# EAGLE schematic Embedded (EAGLE 9.2.1)
Assembly variants: 2

## Sheet 1 of 2
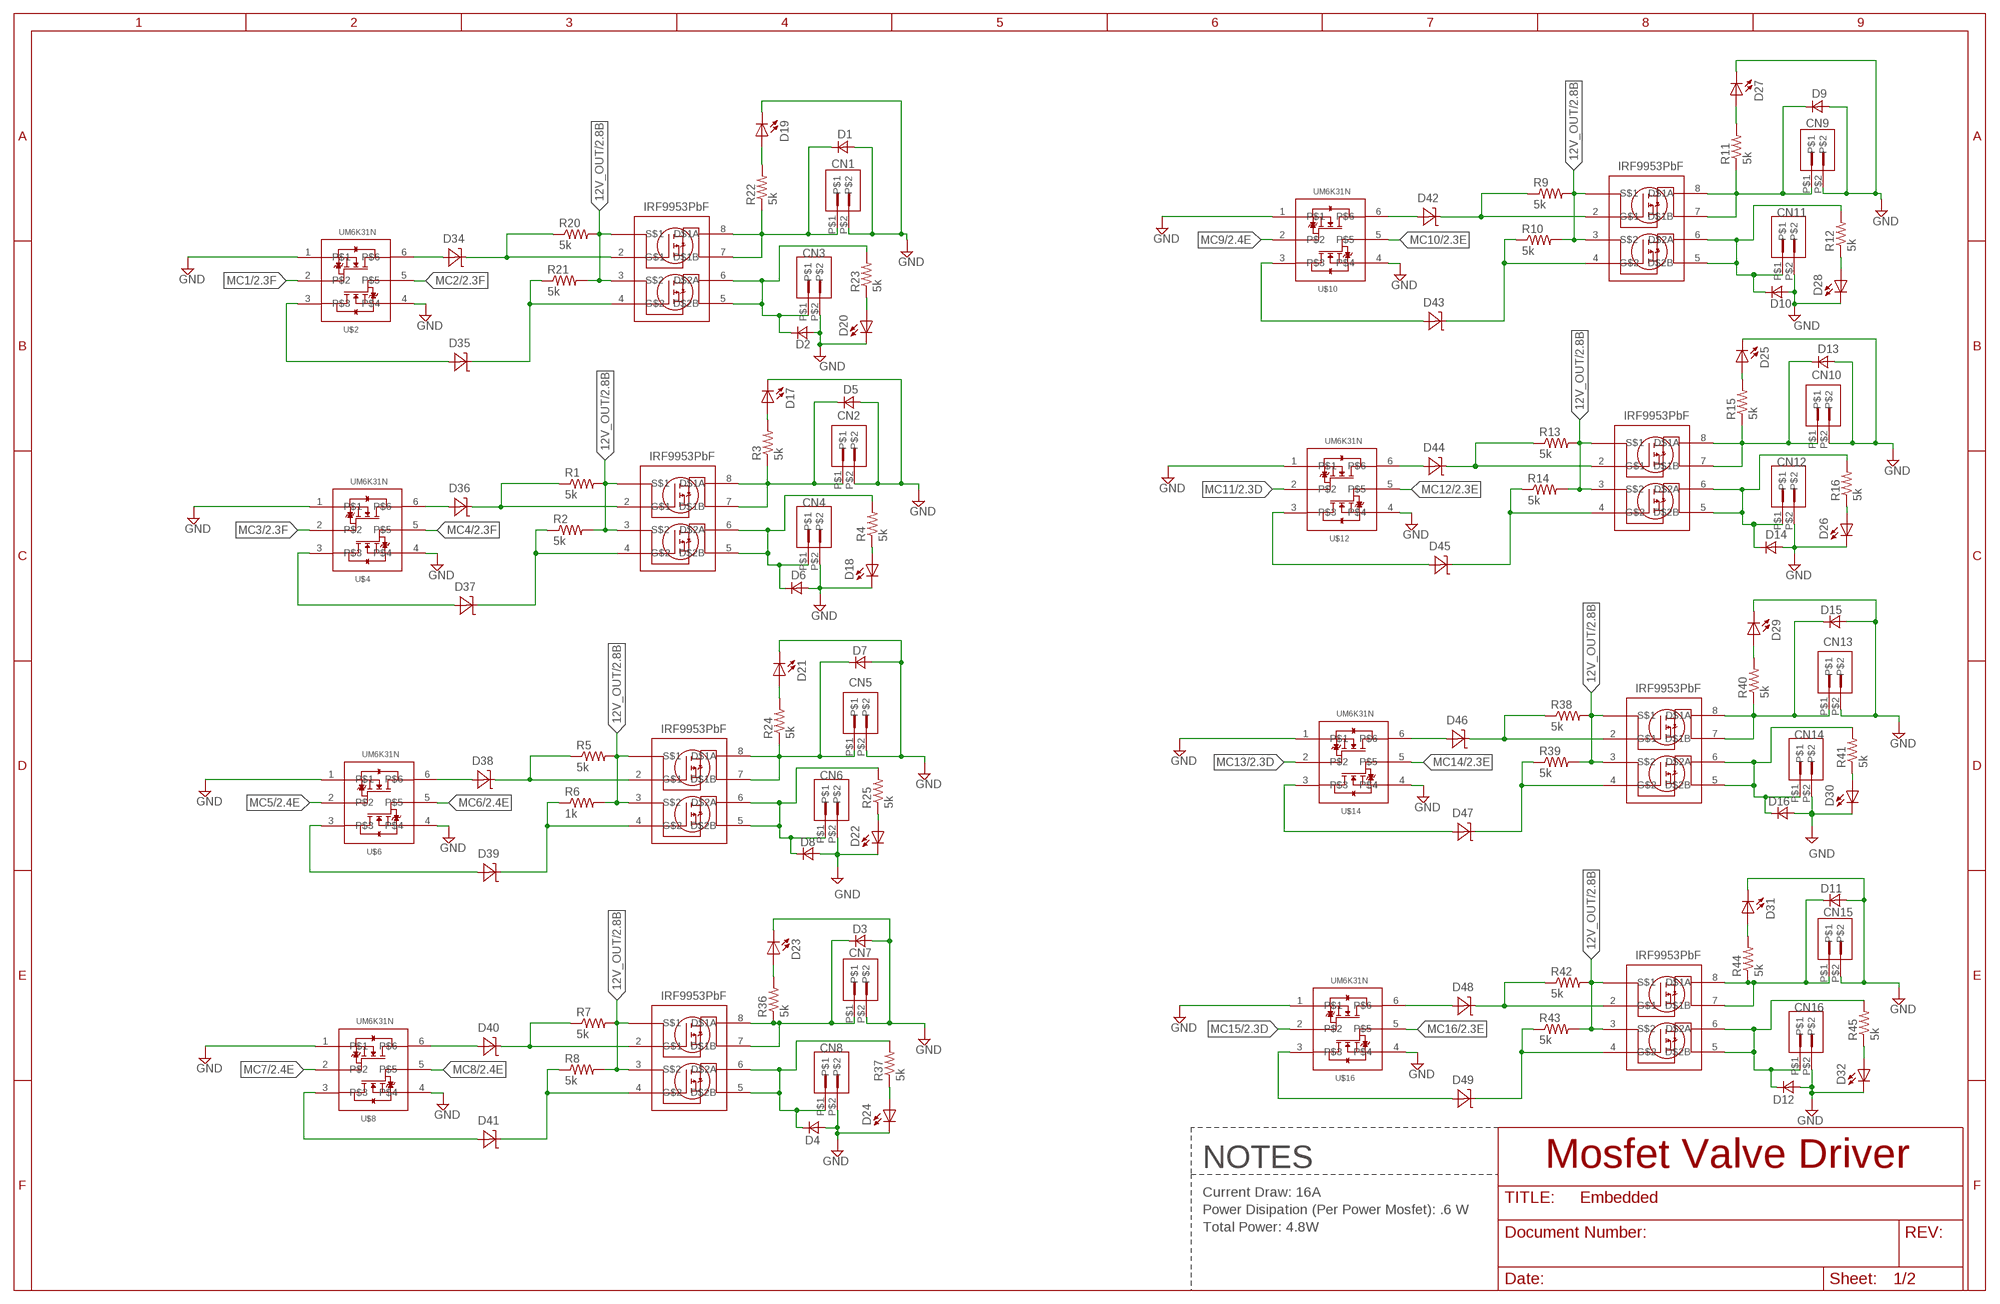
[diagram p0: schematic, sheet 1]

### Parts
CN1  KF2510-2  [KF2540-2]
CN2  KF2510-2  [KF2540-2]
CN3  KF2510-2  [KF2540-2]
CN4  KF2510-2  [KF2540-2]
CN5  KF2510-2  [KF2540-2]
CN6  KF2510-2  [KF2540-2]
CN7  KF2510-2  [KF2540-2]
CN8  KF2510-2  [KF2540-2]
CN9  KF2510-2  [KF2540-2]
CN10  KF2510-2  [KF2540-2]
CN11  KF2510-2  [KF2540-2]
CN12  KF2510-2  [KF2540-2]
CN13  KF2510-2  [KF2540-2]
CN14  KF2510-2  [KF2540-2]
CN15  KF2510-2  [KF2540-2]
CN16  KF2510-2  [KF2540-2]
D1  RS1AL_DIODE  [DO219]
D2  RS1AL_DIODE  [DO219]
D3  RS1AL_DIODE  [DO219]
D4  RS1AL_DIODE  [DO219]
D5  RS1AL_DIODE  [DO219]
D6  RS1AL_DIODE  [DO219]
D7  RS1AL_DIODE  [DO219]
D8  RS1AL_DIODE  [DO219]
D9  RS1AL_DIODE  [DO219]
D10  RS1AL_DIODE  [DO219]
D11  RS1AL_DIODE  [DO219]
D12  RS1AL_DIODE  [DO219]
D13  RS1AL_DIODE  [DO219]
D14  RS1AL_DIODE  [DO219]
D15  RS1AL_DIODE  [DO219]
D16  RS1AL_DIODE  [DO219]
D17  1206LED  [1206]
D18  1206LED  [1206]
D19  1206LED  [1206]
D20  1206LED  [1206]
D21  1206LED  [1206]
D22  1206LED  [1206]
D23  1206LED  [1206]
D24  1206LED  [1206]
D25  1206LED  [1206]
D26  1206LED  [1206]
D27  1206LED  [1206]
D28  1206LED  [1206]
D29  1206LED  [1206]
D30  1206LED  [1206]
D31  1206LED  [1206]
D32  1206LED  [1206]
D34  6.2V  MM3Z6V2B  [SOD_323F]
D35  6.2V  MM3Z6V2B  [SOD_323F]
D36  6.2  MM3Z6V2B  [SOD_323F]
D37  6.2V  MM3Z6V2B  [SOD_323F]
D38  6.2V  MM3Z6V2B  [SOD_323F]
D39  6.2V  MM3Z6V2B  [SOD_323F]
D40  6.2V  MM3Z6V2B  [SOD_323F]
D41  6.2V  MM3Z6V2B  [SOD_323F]
D42  6.2V  MM3Z6V2B  [SOD_323F]
D43  6.2V  MM3Z6V2B  [SOD_323F]
D44  6.2V  MM3Z6V2B  [SOD_323F]
D45  6.2V  MM3Z6V2B  [SOD_323F]
D46  6.2V  MM3Z6V2B  [SOD_323F]
D47  6.2V  MM3Z6V2B  [SOD_323F]
D48  6.2V  MM3Z6V2B  [SOD_323F]
D49  6.2V  MM3Z6V2B  [SOD_323F]
R1  5k  R-US_M0805  [M0805]
R2  5k  R-US_M0805  [M0805]
R3  5k  R-US_M0805  [M0805]
R4  5k  R-US_M0805  [M0805]
R5  5k  R-US_M0805  [M0805]
R6  1k  R-US_M0805  [M0805]
R7  5k  R-US_M0805  [M0805]
R8  5k  R-US_M0805  [M0805]
R9  5k  R-US_M0805  [M0805]
R10  5k  R-US_M0805  [M0805]
R11  5k  R-US_M0805  [M0805]
R12  5k  R-US_M0805  [M0805]
R13  5k  R-US_M0805  [M0805]
R14  5k  R-US_M0805  [M0805]
R15  5k  R-US_M0805  [M0805]
R16  5k  R-US_M0805  [M0805]
R20  5k  R-US_M0805  [M0805]
R21  5k  R-US_M0805  [M0805]
R22  5k  R-US_M0805  [M0805]
R23  5k  R-US_M0805  [M0805]
R24  5k  R-US_M0805  [M0805]
R25  5k  R-US_M0805  [M0805]
R36  5k  R-US_M0805  [M0805]
R37  5k  R-US_M0805  [M0805]
R38  5k  R-US_M0805  [M0805]
R39  5k  R-US_M0805  [M0805]
R40  5k  R-US_M0805  [M0805]
R41  5k  R-US_M0805  [M0805]
R42  5k  R-US_M0805  [M0805]
R43  5k  R-US_M0805  [M0805]
R44  5k  R-US_M0805  [M0805]
R45  5k  R-US_M0805  [M0805]
U$1  IRF9953PBF  [SO-8]
U$2  UM6K31N  [UMT6]
U$3  IRF9953PBF  [SO-8]
U$4  UM6K31N  [UMT6]
U$5  IRF9953PBF  [SO-8]
U$6  UM6K31N  [UMT6]
U$7  IRF9953PBF  [SO-8]
U$8  UM6K31N  [UMT6]
U$9  IRF9953PBF  [SO-8]
U$10  UM6K31N  [UMT6]
U$11  IRF9953PBF  [SO-8]
U$12  UM6K31N  [UMT6]
U$13  IRF9953PBF  [SO-8]
U$14  UM6K31N  [UMT6]
U$15  IRF9953PBF  [SO-8]
U$16  UM6K31N  [UMT6]

### Nets
12V_OUT [GND]: R1.2 R2.2 R5.2 R6.2 R7.2 R8.2 R9.2 R10.2 R13.2 R14.2 R20.2 R21.2 R38.2 R39.2 R42.2 R43.2 U$1.1(S$1) U$1.3(S$2) U$3.1(S$1) U$3.3(S$2) U$5.1(S$1) U$5.3(S$2) U$7.1(S$1) U$7.3(S$2) U$9.1(S$1) U$9.3(S$2) U$11.1(S$1) U$11.3(S$2) U$13.1(S$1) U$13.3(S$2) U$15.1(S$1) U$15.3(S$2) ; also sheet 2
GND: CN1.P$2 CN2.P$2 CN3.P$2 CN4.P$2 CN5.P$2 CN6.P$2 CN7.P$2 CN8.P$2 CN9.P$2 CN10.P$2 CN11.P$2 CN12.P$2 CN13.P$2 CN14.P$2 CN15.P$2 CN16.P$2 D1.A$2(A) D2.A$2(A) D3.A$2(A) D4.A$2(A) D5.A$2(A) D6.A$2(A) D7.A$2(A) D8.A$2(A) D9.A$2(A) D10.A$2(A) D11.A$2(A) D12.A$2(A) D13.A$2(A) D14.A$2(A) D15.A$2(A) D16.A$2(A) D17.P$2(C) D18.P$2(C) D19.P$2(C) D20.P$2(C) D21.P$2(C) D22.P$2(C) D23.P$2(C) D24.P$2(C) D25.P$2(C) D26.P$2(C) D27.P$2(C) D28.P$2(C) D29.P$2(C) D30.P$2(C) D31.P$2(C) D32.P$2(C) U$2.1 U$2.4 U$4.1 U$4.4 U$6.1 U$6.4 U$8.1 U$8.4 U$10.1 U$10.4 U$12.1 U$12.4 U$14.1 U$14.4 U$16.1 U$16.4 ; also sheet 2
MC1: U$2.2 ; also sheet 2
MC2: U$2.5 ; also sheet 2
MC3: U$4.2 ; also sheet 2
MC4: U$4.5 ; also sheet 2
MC5: U$6.2 ; also sheet 2
MC6: U$6.5 ; also sheet 2
MC7: U$8.2 ; also sheet 2
MC8: U$8.5 ; also sheet 2
MC9: U$10.2 ; also sheet 2
MC10: U$10.5 ; also sheet 2
MC11: U$12.2 ; also sheet 2
MC12: U$12.5 ; also sheet 2
MC13: U$14.2 ; also sheet 2
MC14: U$14.5 ; also sheet 2
MC15: U$16.2 ; also sheet 2
MC16: U$16.5 ; also sheet 2
N$1: D35.C R21.1 U$1.4(G$2)
N$2: D35.A U$2.3
N$4: D37.C R2.1 U$3.4(G$2)
N$5: D39.A U$6.3
N$6: D39.C R6.1 U$5.4(G$2)
N$7: D40.A U$8.6
N$8: D41.C R8.1 U$7.4(G$2)
N$9: D43.C R10.1 U$9.4(G$2)
N$10: D45.C R14.1 U$11.4(G$2)
N$11: D47.C R39.1 U$13.4(G$2)
N$12: D49.C R43.1 U$15.4(G$2)
N$13: D44.C R13.1 U$11.2(G$1)
N$14: D45.A U$12.3
N$15: D43.A U$10.3
N$16: D42.C R9.1 U$9.2(G$1)
N$17: D36.C R1.1 U$3.2(G$1)
N$19: D37.A U$4.3
N$27: D36.A U$4.6
N$28: D34.C R20.1 U$1.2(G$1)
N$29: D34.A U$2.6
N$30: D47.A U$14.3
N$31: D46.C R38.1 U$13.2(G$1)
N$32: D49.A U$16.3
N$33: D48.C R42.1 U$15.2(G$1)
N$34: D42.A U$10.6
N$35: D27.P$1(A) R11.2
N$36: D38.A U$6.6
N$37: D38.C R5.1 U$5.2(G$1)
N$38: D40.C R7.1 U$7.2(G$1)
N$39: D41.A U$8.3
N$40: D28.P$1(A) R12.1
N$41: D44.A U$12.6
N$49: D19.P$1(A) R22.2
N$50: D20.P$1(A) R23.1
N$51: D17.P$1(A) R3.2
N$52: D18.P$1(A) R4.1
N$53: D22.P$1(A) R25.1
N$54: D21.P$1(A) R24.2
N$55: D24.P$1(A) R37.1
N$56: D23.P$1(A) R36.2
N$57: D25.P$1(A) R15.2
N$58: D26.P$1(A) R16.1
N$59: D46.A U$14.6
N$60: D30.P$1(A) R41.1
N$61: D29.P$1(A) R40.2
N$62: D48.A U$16.6
N$63: D32.P$1(A) R45.1
N$64: D31.P$1(A) R44.2
VAL_1 [out]: CN1.P$1 D1.C$1(C) R22.1 U$1.7(D$1B) U$1.8(D$1A)
VAL_2 [out]: CN3.P$1 D2.C$1(C) R23.2 U$1.5(D$2B) U$1.6(D$2A)
VAL_3 [out]: CN2.P$1 D5.C$1(C) R3.1 U$3.7(D$1B) U$3.8(D$1A)
VAL_4 [out]: CN4.P$1 D6.C$1(C) R4.2 U$3.5(D$2B) U$3.6(D$2A)
VAL_5 [out]: CN5.P$1 D7.C$1(C) R24.1 U$5.7(D$1B) U$5.8(D$1A)
VAL_6 [out]: CN6.P$1 D8.C$1(C) R25.2 U$5.5(D$2B) U$5.6(D$2A)
VAL_7 [out]: CN7.P$1 D3.C$1(C) R36.1 U$7.7(D$1B) U$7.8(D$1A)
VAL_8 [out]: CN8.P$1 D4.C$1(C) R37.2 U$7.5(D$2B) U$7.6(D$2A)
VAL_9 [out]: CN9.P$1 D9.C$1(C) R11.1 U$9.7(D$1B) U$9.8(D$1A)
VAL_10: CN11.P$1 D10.C$1(C) R12.2 U$9.5(D$2B) U$9.6(D$2A)
VAL_11 [out]: CN10.P$1 D13.C$1(C) R15.1 U$11.7(D$1B) U$11.8(D$1A)
VAL_12 [out]: CN12.P$1 D14.C$1(C) R16.2 U$11.5(D$2B) U$11.6(D$2A)
VAL_13 [out]: CN13.P$1 D15.C$1(C) R40.1 U$13.7(D$1B) U$13.8(D$1A)
VAL_14 [out]: CN14.P$1 D16.C$1(C) R41.2 U$13.5(D$2B) U$13.6(D$2A)
VAL_15 [out]: CN15.P$1 D11.C$1(C) R44.1 U$15.7(D$1B) U$15.8(D$1A)
VAL_16 [out]: CN16.P$1 D12.C$1(C) R45.2 U$15.5(D$2B) U$15.6(D$2A)

### Notes on the sheet
- NOTES | Mosfet Valve Driver
- Current Draw: 16A
- Power Disipation (Per Power Mosfet): .6 W
- Total Power: 4.8W

## Sheet 2 of 2
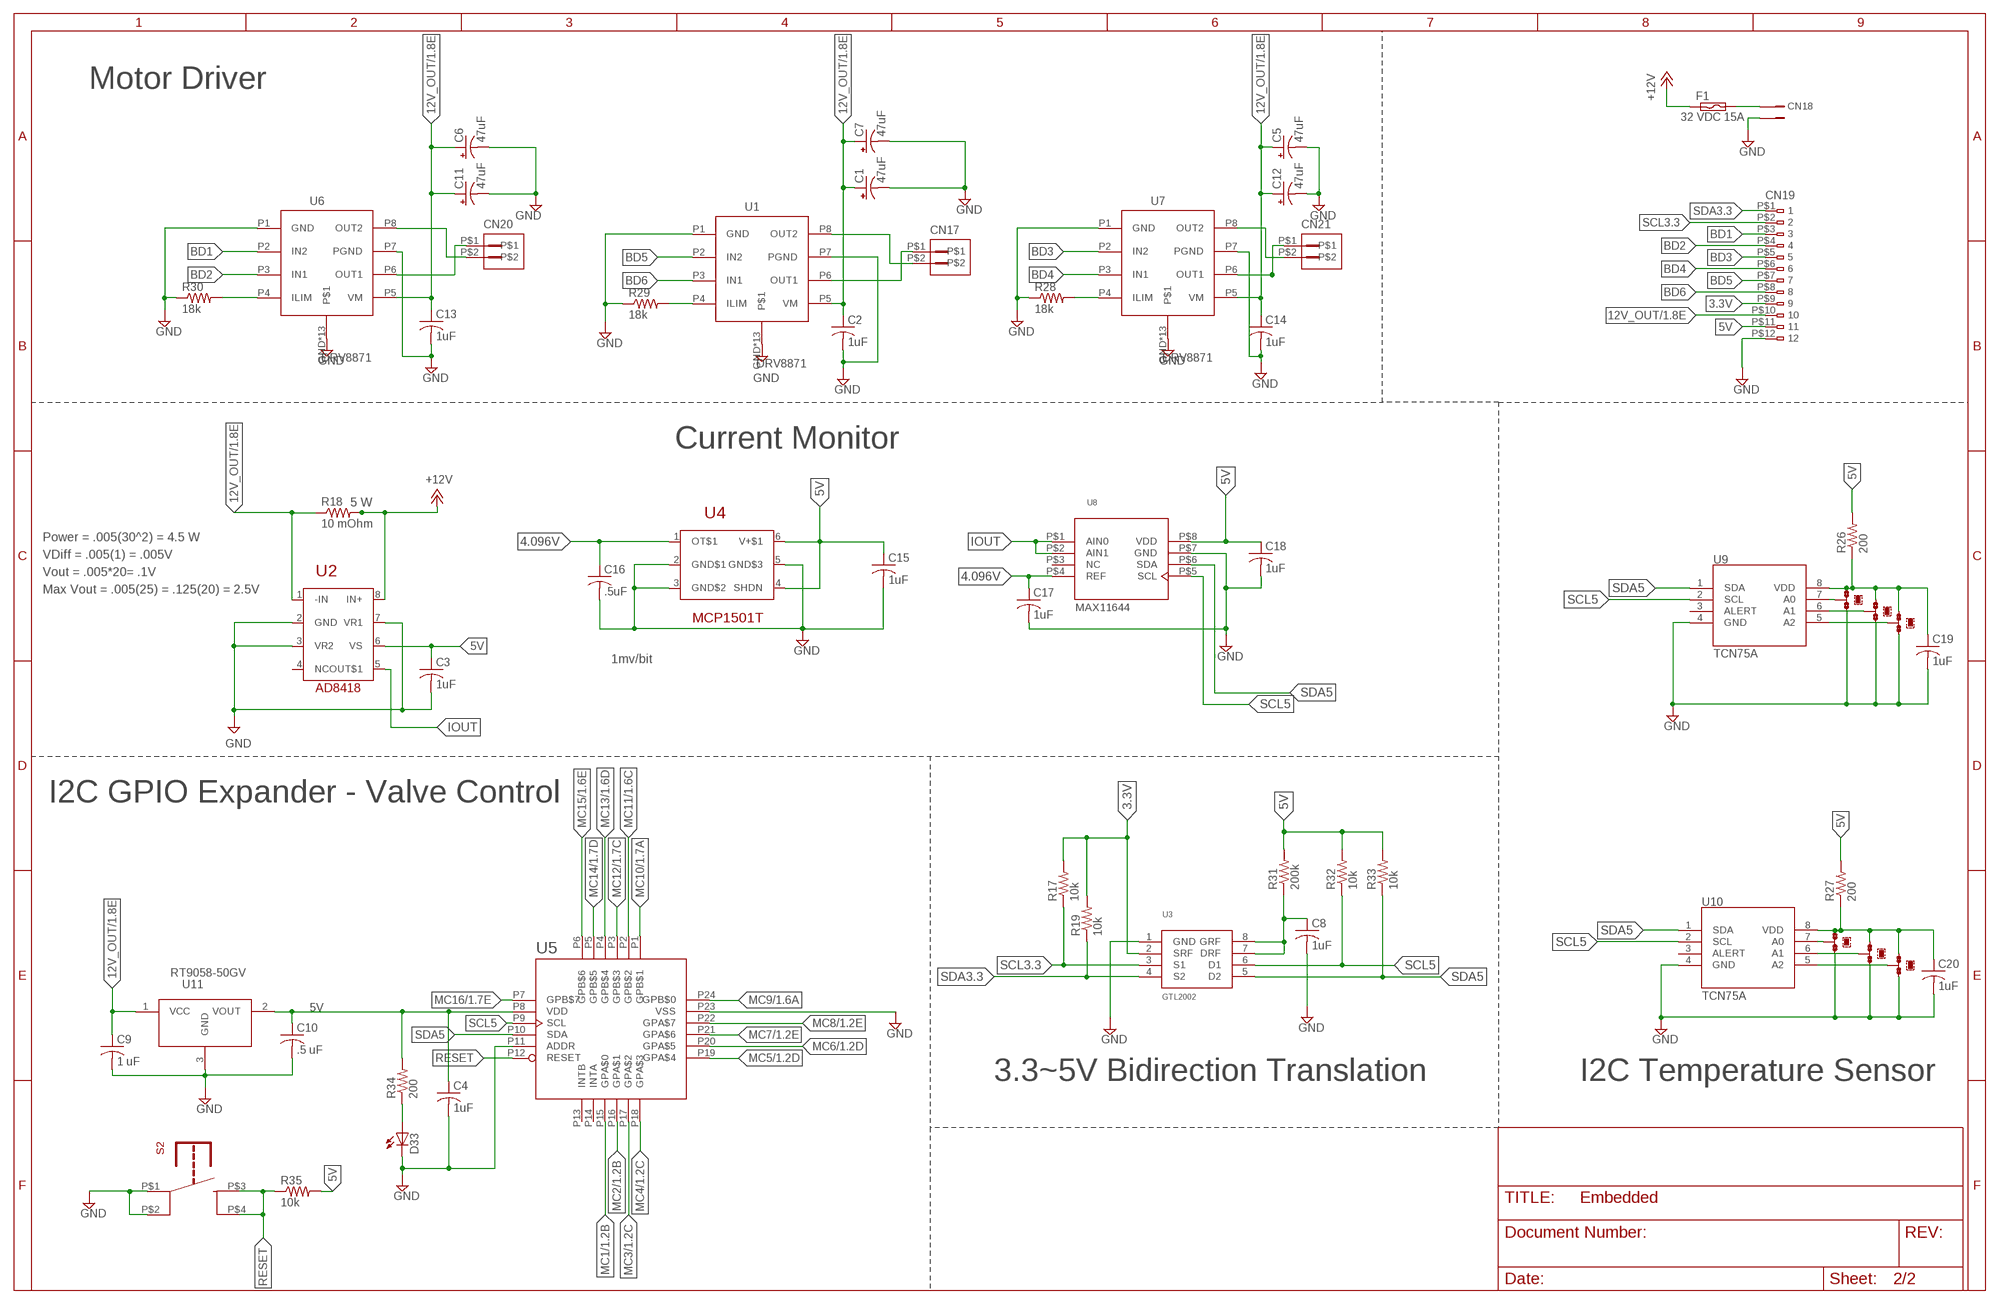
[diagram p1: schematic, sheet 2]

### Parts
C1  47uF  CPOL-USUD-6,3X7,7  [UD-6,3X7,7_NICHICON]
C2  1uF  C-USC1206  [C1206]
C3  1uF  C-USC1206  [C1206]
C4  1uF  C-USC1206  [C1206]
C5  47uF  CPOL-USUD-6,3X7,7  [UD-6,3X7,7_NICHICON]
C6  47uF  CPOL-USUD-6,3X7,7  [UD-6,3X7,7_NICHICON]
C7  47uF  CPOL-USUD-6,3X7,7  [UD-6,3X7,7_NICHICON]
C8  1uF  C-USC1206  [C1206]
C9  1 uF  C-USC1206  [C1206]
C10  .5 uF  C-USC1206  [C1206]
C11  47uF  CPOL-USUD-6,3X7,7  [UD-6,3X7,7_NICHICON]
C12  47uF  CPOL-USUD-6,3X7,7  [UD-6,3X7,7_NICHICON]
C13  1uF  C-USC1206  [C1206]
C14  1uF  C-USC1206  [C1206]
C15  1uF  C-USC1206  [C1206]
C16  .5uF  C-USC1206  [C1206]
C17  1uF  C-USC1206  [C1206]
C18  1uF  C-USC1206  [C1206]
C19  1uF  C-USC1206  [C1206]
C20  1uF  C-USC1206  [C1206]
CN17  KF2510-2  [KF2540-2]
CN18  PHEON_MKDS_CON  [PHOEN_MKDS]
CN19  MOLEX_FPC_52892_1233  [MOLEX_WM1108]
CN20  KF2510-2  [KF2540-2]
CN21  KF2510-2  [KF2540-2]
D33  1206LED  [1206]
F1  32 VDC 15A  LITTLEFUSE_AGU  [LITTLEFUSE125_003]
JMP1  0R-JUMPA  [A0R-JMP]
JMP2  0R-JUMPA  [A0R-JMP]
JMP3  0R-JUMPA  [A0R-JMP]
JMP4  0R-JUMPA  [A0R-JMP]
JMP5  0R-JUMPA  [A0R-JMP]
JMP6  0R-JUMPA  [A0R-JMP]
R17  10k  R-US_M0805  [M0805]
R18  10 mOhm  WSHM2818  [2818]
R19  10k  R-US_M0805  [M0805]
R26  200  R-US_M0805  [M0805]
R27  200  R-US_M0805  [M0805]
R28  18k  R-US_M0805  [M0805]
R29  18k  R-US_M0805  [M0805]
R30  18k  R-US_M0805  [M0805]
R31  200k  R-US_M0805  [M0805]
R32  10k  R-US_M0805  [M0805]
R33  10k  R-US_M0805  [M0805]
R34  200  R-US_M0805  [M0805]
R35  10k  R-US_M0805  [M0805]
S2  TL3305  [TL3305]
U1  DRV8871  [SO8_EP]
U2  AD8418BZR  [DGK_S-PDSO-G8]
U3  GTL2002  [SO-8]
U4  MCP1501T-40E/CHY  [SOT23-6]
U5  MCP23018  [QFN_24_EP]
U6  DRV8871  [SO8_EP]
U7  DRV8871  [SO8_EP]
U8  MAX11645UMAX8  [UMAX8]
U9  TCN75A  [DGK_S-PDSO-G8]
U10  TCN75A  [DGK_S-PDSO-G8]
U11  RT9058-50GV  [SOT23]

### Nets
3.3V: CN19.P$9 R17.2 R19.2 U3.2(SRF)
4.096V: C16.1 C17.1 U4.1(OT$1) U8.P$4(REF)
5V [5V]: C3.1 C4.1 C10.1 C15.1 C18.1 CN19.P$11 R26.2 R27.2 R31.2 R32.2 R33.2 R34.2 R35.2 U2.6(VS) U4.4(SHDN) U4.6(V+$1) U5.P8(VDD) U8.P$8(VDD) U11.2(VOUT)
12V_OUT [GND]: C1.+ C2.1 C5.+ C6.+ C7.+ C9.1 C11.+ C12.+ C13.1 C14.1 CN19.P$10 R18.P$1 U1.P5(VM) U2.1(-IN) U6.P5(VM) U7.P5(VM) U11.1(VCC) ; also sheet 1
+12V [12V_OUT]: F1.P$1 R18.P$2 U2.8(IN+)
BD1: CN19.P$3 U6.P2(IN2)
BD2: CN19.P$4 U6.P3(IN1)
BD3: CN19.P$5 U7.P2(IN2)
BD4: CN19.P$6 U7.P3(IN1)
BD5: CN19.P$7 U1.P2(IN2)
BD6: CN19.P$8 U1.P3(IN1)
GND: C1.- C2.2 C3.2 C4.2 C5.- C6.- C7.- C8.2 C9.2 C10.2 C11.- C12.- C13.2 C14.2 C15.2 C16.2 C17.2 C18.2 C19.2 C20.2 CN18.P$2 CN19.P$12 D33.P$2(C) JMP1.1 JMP2.1 JMP3.1 JMP4.1 JMP5.1 JMP6.1 R28.1 R29.1 R30.1 S2.P$1 S2.P$2 U1.GND U1.P1(GND) U1.P7(PGND) U1.P$1 U1.P$2 U1.P$3 U1.P$4 U1.P$5 U1.P$6 U1.P$7 U1.P$8 U1.P$9 U1.P$10 U1.P$11 U1.P$12 U2.2(GND) U2.3(VR2) U2.7(VR1) U3.1(GND) U4.2(GND$1) U4.3(GND$2) U4.5(GND$3) U5.P11(ADDR) U5.P23(VSS) U6.GND U6.P1(GND) U6.P7(PGND) U6.P$1 U6.P$2 U6.P$3 U6.P$4 U6.P$5 U6.P$6 U6.P$7 U6.P$8 U6.P$9 U6.P$10 U6.P$11 U6.P$12 U7.GND U7.P1(GND) U7.P7(PGND) U7.P$1 U7.P$2 U7.P$3 U7.P$4 U7.P$5 U7.P$6 U7.P$7 U7.P$8 U7.P$9 U7.P$10 U7.P$11 U7.P$12 U8.P$7(GND) U9.4(GND) U10.4(GND) U11.3(GND) ; also sheet 1
IOUT: U2.5(OUT$1) U8.P$1(AIN0) U8.P$2(AIN1)
KLJL [5V]: C8.1 R31.1 U3.7(DRF) U3.8(GRF)
MC1: U5.P15(GPA$0) ; also sheet 1
MC2: U5.P16(GPA$1) ; also sheet 1
MC3: U5.P17(GPA$2) ; also sheet 1
MC4: U5.P18(GPA$3) ; also sheet 1
MC5: U5.P19(GPA$4) ; also sheet 1
MC6: U5.P20(GPA$5) ; also sheet 1
MC7: U5.P21(GPA$6) ; also sheet 1
MC8: U5.P22(GPA$7) ; also sheet 1
MC9: U5.P24(GPB$0) ; also sheet 1
MC10: U5.P1(GPB$1) ; also sheet 1
MC11: U5.P2(GPB$2) ; also sheet 1
MC12: U5.P3(GPB$3) ; also sheet 1
MC13: U5.P4(GPB$4) ; also sheet 1
MC14: U5.P5(GPB$5) ; also sheet 1
MC15: U5.P6(GPB$6) ; also sheet 1
MC16: U5.P7(GPB$7) ; also sheet 1
N$3: R29.2 U1.P4(ILIM)
N$18 [GND]: CN17.P$2 U1.P8(OUT2)
N$20: D33.P$1(A) R34.1
N$21 [GND]: CN17.P$1 U1.P6(OUT1)
N$22: JMP1.2 U9.7(A0)
N$23: JMP2.2 U9.6(A1)
N$24: JMP3.2 U9.5(A2)
N$25: JMP4.2 U10.7(A0)
N$26: JMP5.2 U10.6(A1)
N$42: R30.2 U6.P4(ILIM)
N$43: R28.2 U7.P4(ILIM)
N$44 [GND]: CN20.P$2 U6.P8(OUT2)
N$45 [GND]: CN20.P$1 U6.P6(OUT1)
N$46 [out]: CN21.P$1 U7.P6(OUT1)
N$47 [GND]: CN21.P$2 U7.P8(OUT2)
N$48: JMP6.2 U10.5(A2)
N$65: CN18.P$1 F1.P$2
ONKL [5V]: C20.1 JMP4.3 JMP5.3 JMP6.3 R27.1 U10.8(VDD)
RESET [5V]: R35.1 S2.P$3 S2.P$4 U5.P12(RESET)
SCL3.3: CN19.P$2 R17.1 U3.3(S1)
SCL5: R32.1 U3.6(D1) U5.P9(SCL) U8.P$5(SCL) U9.2(SCL) U10.2(SCL)
SDA3.3: CN19.P$1 R19.1 U3.4(S2)
SDA5: R33.1 U3.5(D2) U5.P10(SDA) U8.P$6(SDA) U9.1(SDA) U10.1(SDA)
UOY [5V]: C19.1 JMP1.3 JMP2.3 JMP3.3 R26.1 U9.8(VDD)
Unconnected: U2.4(NC) U5.P13(INTB) U5.P14(INTA) U8.P$3(NC) U9.3(ALERT) U10.3(ALERT)

### Notes on the sheet
- Motor Driver
- Current Monitor
- 5 W
- Power = .005(30^2) = 4.5 W
- VDiff = .005(1) = .005V
- Vout = .005*20= .1V
- Max Vout = .005(25) = .125(20) = 2.5V
- 1mv/bit
- I2C GPIO Expander - Valve Control
- 3.3~5V Bidirection Translation | I2C Temperature Sensor

## Library data of the parts
C1 C5-C7 C11 C12 = rcl:CPOL-US: POLARIZED CAPACITOR, American symbol; SPICEPREFIX: C
C2-C4 C8 C13-C20 = rcl:C-US: CAPACITOR, American symbol; SPICEPREFIX: C
C9 C10 = resistor:C-US: CAPACITOR, American symbol
CN1-CN17 CN20 CN21 = Metvoc:KF2510-2: KF2510-2 - 2 PIN Molex Connector
CN18 = PassTransistor:PHEON_MKDS_CON: Phoenix Contact - Combicon MKDS: 2 Position Screw Terminal Specifications: Manufacturer: Phoenix Contact Series: COMBICON MKDS Positions: 2 Pitch: 0.300" (7.62mm) Current: 30A Voltage: 300V Wire Gauge: 10-30 AWG Datasheet: 1868076 <https://media.digikey.com/PDF/Data%20Sheets/Phoenix%20Contact%20PDFs/1868076.pdf> Digi-Key Part #: 277-5840-ND <https://www.digikey.com/product-detail/en/phoenix-contact/1868076/277-5840-ND/2511066>
CN19 = PassTransistor:MOLEX_FPC_52892_1233: Molex 12 Pin FPC: Specifications: Manufacturer: Molex, LLC Flat Flex Type: FFC,FPC Mounting Type: Surface Mount Connector/Contact Type: Contacts, Bottom Number of Positions: 12 Pitch: 0.020" (0.50 mm) FFC,FCB Thickness: 0.30mm Voltage Rating: 50V Current Rating: 0.5A Datasheet: 52892-xx33 <https://www.molex.com/pdm_docs/sd/528922433_sd.pdf> Digi-Key Part #: WM11084CT-ND <https://www.digikey.com/product-detail/en/molex-llc/0528921233/WM11084CT-ND/5171211>
D1-D16 = PassTransistor:RS1AL_DIODE: RS1AL: 800mA 50V Diode Specifications: Manufacturer: Taiwan Semiconductor Diode Type: Standard DC Reverse (V): 50V Current: 800 mA Datasheet: RS1AL <https://www.taiwansemi.com/products/datasheet/RS1AL%20SERIES_M15.pdf> Digi-Key Part #: RS1ALRVGCT-ND <https://www.digikey.com/product-detail/en/taiwan-semiconductor-corporation/RS1AL-RVG/RS1ALRVGCT-ND/7358032>
D17-D33 = PassTransistor:1206LED
D34-D49 = PassTransistor:MM3Z6V2B: MM3Z6V2B: Zener Diode Specifications: Manufacturer: ON Semiconductor Power-Max: 200mW Impedance (Max): 9 Ohms Current - Reverse Leakage @ Vr: 2.7uA @ 4V Voltage - Forward (Vf) (Max) @ if: 1V @ 10 mA Mounting Type: Surface Mount Package / Case: SOD-323F Datasheet: MM3Z2V4B-MM3Z75VB <http://www.onsemi.com/pub/Collateral/MM3Z9V1B-D.pdf> Digi-Key Part #: MM3Z6V2BCT-ND <https://www.digikey.com/product-detail/en/on-semiconductor/MM3Z6V2B/MM3Z6V2BCT-ND/1626907>
F1 = PassTransistor:LITTLEFUSE_AGU: Littlefuse AGU Fuse: Specifications: Manufacturer: Littlefuse, Inc. Series: AGU Fuse Type: Cartridge, Glass Datasheet: AG, SFE, GBS Series Automotive <https://www.littelfuse.com/~/media/automotive/datasheets/fuses/automotive-aftermarket/glass-fuses/littelfuse_aftermarket_glass.pdf> Digi-Key Part #: F5026-ND <https://www.digikey.com/product-detail/en/littelfuse-inc/0AGU030.T/F5026-ND/2519208>
JMP1-JMP6 = jump-0r-smd:0R-JUMP: SMD 0R 0805 Jumper
R1-R17 R19-R45 = resistor:R-US_: RESISTOR, American symbol
R18 = PassTransistor:WSHM2818: WSHM2818: .01 Ohm 7W Resistor Specifications: Manufacturer: Vishay Dale Resistance: 10 mOhms Tolerance: ± 1% Power: 7W Datasheet: WSHM2818 <http://www.vishay.com/docs/30188/wshm2818.pdf> Digi-Key Part #: 541-2626-1-ND <https://www.digikey.com/product-detail/en/vishay-dale/WSHM2818R0100FEA/541-2626-1-ND/5419333>
S2 = ATMEGA328PB-AN:TL3305: TL3305: Momentary SPST Switch Specifications: Circuit: SPST-NO Mounting Type: Surface Mount Datasheet: TL3305 <http://spec_sheets.e-switch.com/specs/P010468.pdf> Digi-Key Part #: EG5350CT-ND <https://www.digikey.com/product-detail/en/e-switch/TL3305AF160QG/EG5350TR-ND/5816181>
U1 U6 U7 = DC_Brushed_Motor:DRV8871: DRV8871: Brushed DC Motor Driver Specifications: Manufacturer: Texas Instruments Motor Type: Brushed DC Interface: PWM Technology: NMOS Current Output: 3.6 A Voltage Supply: 0V ~ 5.5V Voltage Load: 6.5V ~ 45V Package: 8--PowerSOIC Datasheet: DRV8871 <Beginning STM32: Developing with FreeRTOS, libopencm3 and GCC> Digi-Key Part #: 296-44509-5-ND <https://www.digikey.com/product-detail/en/Texas+Instruments/DRV8871DDA/296-44509-5-ND/6110574>
U2 = ATMEGA328PB-AN:AD8418BZR
U3 = PassTransistor:GTL2002: GRL2002: 2-Bit Bidirectional Low Voltage Translator Specifications: Manufacturer: NXP Semiconductors Translator Type: Voltage Level Channel Type: Bidirectional Voltage - VCCA: 1V~5.5V Voltage - VCCB: 1V~5.5V Output Type: Open Drain Package: 8-SOIC Datasheet: GTL2002 <https://www.nxp.com/docs/en/data-sheet/GTL2002.pdf> Digi-Key Part #: 568-5019-1-ND <https://www.digikey.com/product-detail/en/nxp-usa-inc/GTL2002D118/568-5019-1-ND/2209933>
U4 = ATMEGA328PB-AN:MCP1501T-40E/CHY: MCP1501: 4.096 Voltage Reference Specifications Manufacture: Microchip Package: SOT-23-6 Output Voltage: 4.096 V Max Input Voltage: 5.5 V Datasheet: MCP1501 <https://www.mouser.com/datasheet/2/268/20005474C-961722.pdf> Mouser Part #: 579-MCP1501T-40E/CHY <https://www.mouser.com/ProductDetail/579-MCP1501T-40E-CHY>
U5 = PassTransistor:MCP23018: MCP23018: 16 GPIO I2C Expander Specifications: Manufacturer: Microchip Techonolgy Number of IO: 16 Interface:I2C Current - Output Source/Sink: 25 mA Voltage - Supply: 1.8 V ~ 5.5 V Package: 24-VFQFN Exposed Pad Datasheet: MCP23018 <http://ww1.microchip.com/downloads/en/DeviceDoc/22103a.pdf> Digi-Key Part #: MCP23018-E/MJ-ND <https://www.digikey.com/product-detail/en/microchip-technology/MCP23018-E-MJ/MCP23018-E-MJ-ND/1999503>
U8 = PassTransistor:MAX11645: MAX11644: I2C 12-Bit ADC Specifications: Manufacturer: Maxim Integrated Number of Bits: 12 Samping Rate (Per Second): 94.4k Number of Inputs: 1,2 Data Inteface: I2C Supply Voltage: 4.5V~5.5V Internal Reference: 4.096V Datasheet: MAX11644-45 <https://datasheets.maximintegrated.com/en/ds/MAX11644-MAX11645.pdf> Mouser Part #: 700-MAX11644EUA+ <https://www.mouser.com/ProductDetail/Maxim-Integrated/MAX11644EUA%2b?qs=sGAEpiMZZMvTvDTV69d2QoFZUXoSN7HGTKKUvUUMoG0%3d>
U9 U10 = PassTransistor:TCN75A: TCN75A: I2C Thermometer Specification: Manufacturer: Microchip Technology Sensing Temperature - Local: -40C~125C Output Type: I2C Voltage - Supply: 2.7~5.5V Package: MSOP-8 Datasheet: TCN75A <http://ww1.microchip.com/downloads/en/DeviceDoc/21935D.pdf> Digi-Key Part #: TCN75AVUA713CT-ND <https://www.digikey.com/product-detail/en/microchip-technology/TCN75AVUA713/TCN75AVUA713CT-ND/7065617>
U11 = PassTransistor:RT9058-50GV: Richtek RT9058-50GV: 5V 100mA Regulator Specifications: Manufacturer: Richtek USA Inc. Output Type: Fixed Voltage - Input (Max): 36V Voltage - Output: 5V Current: 100mA Digi-Key Part #: 1028-1254-1-ND <https://www.digikey.com/product-detail/en/richtek-usa-inc/RT9058-50GV/1028-1254-1-ND/4021247>
U$1 U$3 U$5 U$7 U$9 U$11 U$13 U$15 = PassTransistor:IRF9953PBF: IRF9953PbF: Dual P-Channel Mosfet Specifications: Manufacturer: Infineon Technologies FET Type: 2 P-Channel (Dual) Vdss: 30V Id Max: 2.3A Rds On (Max): 250 mOhm @ 1A, 10V Package: 8-SOIC Datasheet: IRF9953PbF <https://www.infineon.com/dgdl/irf9953pbf.pdf?fileId=5546d462533600a40153561208041dd7> Digi-Key Part #: IRF9953PBFCT-ND <https://www.digikey.com/product-detail/en/infineon-technologies/IRF9953TRPBF/IRF9953PBFCT-ND/827900>
U$2 U$4 U$6 U$8 U$10 U$12 U$14 U$16 = PassTransistor:UM6K31N: UM6K31N: Dual Channel NMOS Specifications: Manufacturer: Rohm Semiconductor FET Type: 2 N-Channel (Dual) Vdss: 60V Id (Max): 250 mA Rds On (Max): 2.4 Ohm @ 250mA, 10V Vgs(th) (Max) @ Id: 2.3V @ 1mA Package: 6-TSSOP, SC-88, SOT-363 Datasheet: UM6K31N <https://www.rohm.com/datasheet/UM6K31N/um6k31n-e> Digi-Key Part #: UM6K31NTNCT-ND <https://www.digikey.com/product-detail/en/rohm-semiconductor/UM6K31NTN/UM6K31NTNCT-ND/4571462>

## Net classes
1 GND: width 2.54 mm
2 12V_OUT: width 2.54 mm, clearance 0.127 mm
3 5V: width 0.127 mm, clearance 0.013 mm
4 out: width 0.381 mm